# Altium schematic sheet MicroControllerSTM32f103.SchDoc
size A4
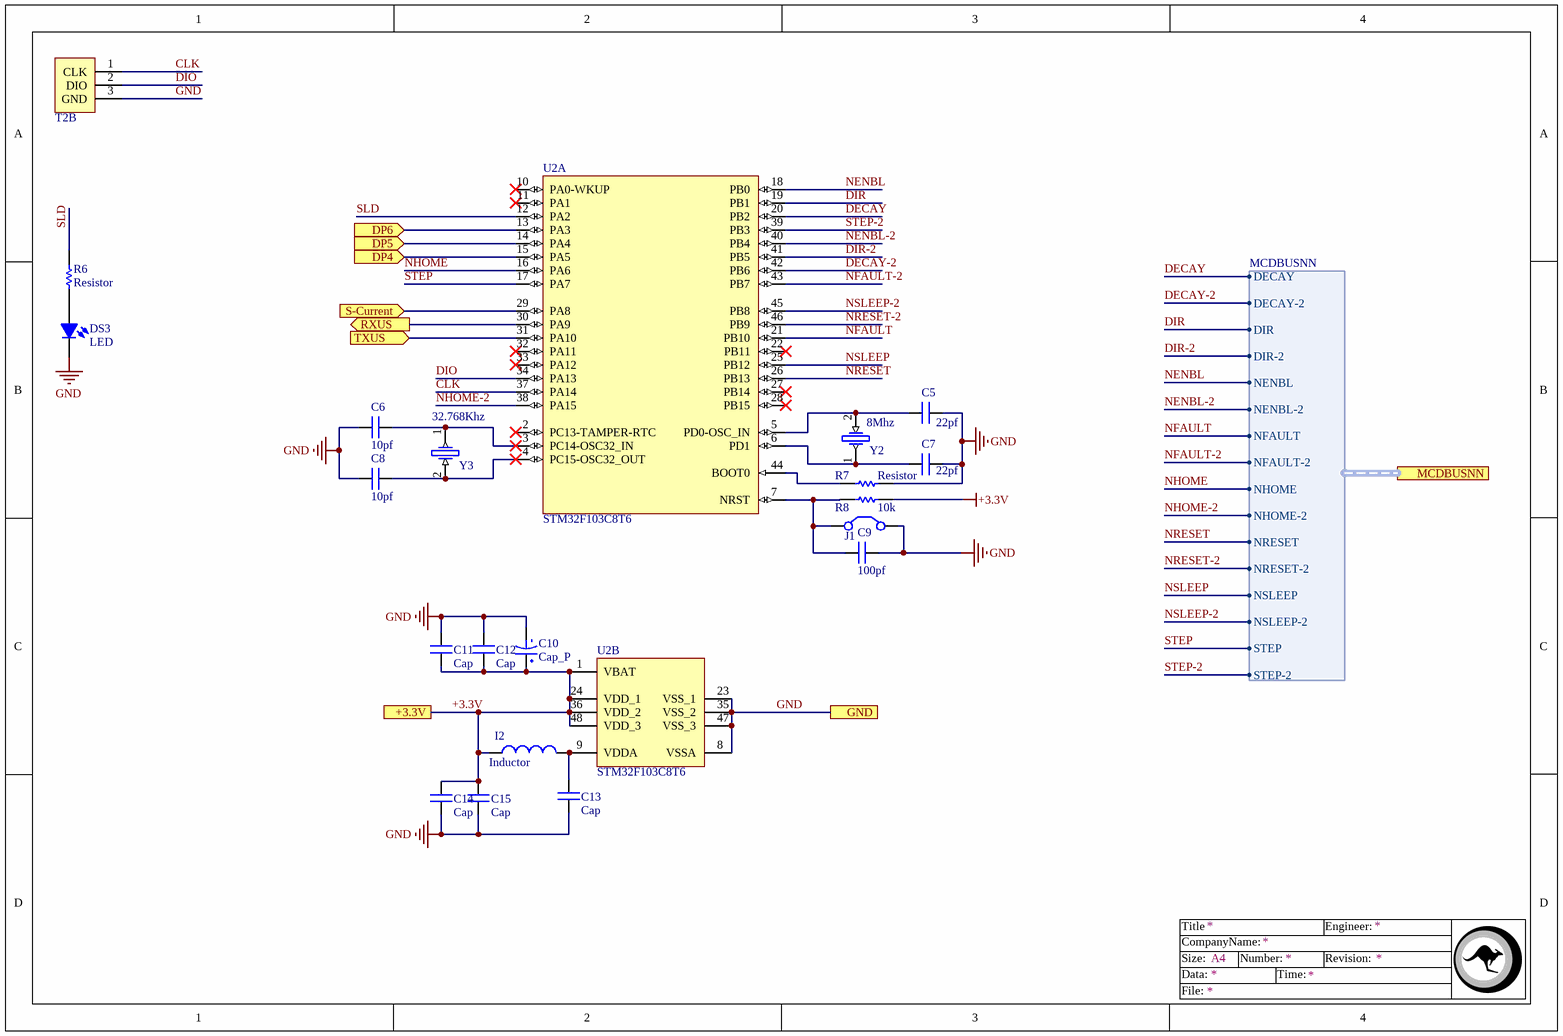
[diagram p0: MicroControllerSTM32f103.SchDoc]

## Parts
C5  22pf  [Cap0805]
C6  10pf  [Cap0805]
C7  22pf  [Cap0805]
C8  10pf  [Cap0805]
C9  100pf  [Cap0805]
C10  Cap_P  [CAPMOL_C]
C11  Cap  [Cap0805]
C12  Cap  [Cap0805]
C13  Cap  [Cap0805]
C14  Cap  [Cap0805]
C15  Cap  [Cap0805]
DS3  LED  [Led0805]
I2  Inductor  [1206]
J1  Jumper  [Jumper SMD - Small]  (value not drawn)
R6  Resistor  [R0805]
R7  Resistor  [R0805]
R8  10k  [R0805]
T2  Serial Program  [MHDR1X03-254P - E]  (value not drawn)  (part B of 2)
U2  STM32F103C8T6  [LQFP48_L]  (parts A,B of 2)
Y2  8Mhz  [CrystallB]
Y3  32.768Khz  [CrystallB]

## Ports
+3.3V, DP4 (in), DP5 (in), DP6 (in), GND, MCDBUSNN (harness MCDBUSNN), RXUS (out), S-Current (in), TXUS (in)

## Harnesses
MCDBUSNN: DECAY, DECAY-2, DIR, DIR-2, NENBL, NENBL-2, NFAULT, NFAULT-2, NHOME, NHOME-2, NRESET, NRESET-2, NSLEEP, NSLEEP-2, STEP, STEP-2

## Nets
+3.3V: C10.2 C11.1 C12.1 C14.2 C15.2 I2.1 R8.1 U2.1(VBAT) U2.24(VDD_1) U2.36(VDD_2) U2.48(VDD_3) ; port +3.3V
GND: C5.1 C6.1 C7.1 C8.1 C9.2 C10.1 C11.2 C12.2 C13.1 C14.1 C15.1 DS3.K J1.2(C2) R7.2 T2.3(GND) U2.8(VSSA) U2.23(VSS_1) U2.35(VSS_2) U2.47(VSS_3) ; port GND
CLK: T2.1(CLK) U2.37(PA14)
DECAY: U2.20(PB2) ; port MCDBUSNN.DECAY
DECAY-2: U2.42(PB6) ; port MCDBUSNN.DECAY-2
DIO: T2.2(DIO) U2.34(PA13)
DIR: U2.19(PB1) ; port MCDBUSNN.DIR
DIR-2: U2.41(PB5) ; port MCDBUSNN.DIR-2
DP4: U2.15(PA5) ; port DP4
DP5: U2.14(PA4) ; port DP5
DP6: U2.13(PA3) ; port DP6
NENBL: U2.18(PB0) ; port MCDBUSNN.NENBL
NENBL-2: U2.40(PB4) ; port MCDBUSNN.NENBL-2
NFAULT: U2.21(PB10) ; port MCDBUSNN.NFAULT
NFAULT-2: U2.43(PB7) ; port MCDBUSNN.NFAULT-2
NHOME: U2.16(PA6) ; port MCDBUSNN.NHOME
NHOME-2: U2.38(PA15) ; port MCDBUSNN.NHOME-2
NRESET: U2.26(PB13) ; port MCDBUSNN.NRESET
NRESET-2: U2.46(PB9) ; port MCDBUSNN.NRESET-2
NSLEEP: U2.25(PB12) ; port MCDBUSNN.NSLEEP
NSLEEP-2: U2.45(PB8) ; port MCDBUSNN.NSLEEP-2
RXUS: U2.30(PA9) ; port RXUS
S-Current: U2.29(PA8) ; port S-Current
SLD: R6.1 U2.12(PA2)
STEP: U2.17(PA7) ; port MCDBUSNN.STEP
STEP-2: U2.39(PB3) ; port MCDBUSNN.STEP-2
TXUS: U2.31(PA10) ; port TXUS
NetC5_2: C5.2 U2.5(PD0-OSC_IN) Y2.2
NetC6_2: C6.2 U2.3(PC14-OSC32_IN) Y3.1
NetC7_2: C7.2 U2.6(PD1) Y2.1
NetC8_2: C8.2 U2.4(PC15-OSC32_OUT) Y3.2
NetC9_1: C9.1 J1.1(C1) R8.2 U2.7(NRST)
NetC13_2: C13.2 I2.2 U2.9(VDDA)
NetDS3_A: DS3.A R6.2
NetR7_1: R7.1 U2.44(BOOT0)

Not connected (* = marked no-connect by the designer): U2 2(PC13-TAMPER-RTC)* 10(PA0-WKUP)* 11(PA1)* 22(PB11)* 27(PB14)* 28(PB15)* 32(PA11)* 33(PA12)*

## Notes on the sheet
- Title
- Size:
- Data:
- CompanyName:
- A4
- Number:
- Time:
- Revision:
- Engineer:
- File:

## Library data of the parts
C5-C9 C11-C15 = Cap: Surface mount Capacitor
C10 = Cap_P: Polarity
I2 = Inductor: Indicator
R8 = Resistor
T2 = Serial Program: STM Serial Program pin
U2 = STM32F103C8T6: STM32 ARM-based 32-bit MCU Performance Line with 64 kB Flash, 20 kB Internal RAM, -40 to +85°C Temperature, 48-Pin LQFP, Tray; DatasheetVersion: rev13.0, Apr-2011; PackageVersion: rev13, Apr-2011; PackageReference: LQFP48; PackageDescription: 48-Pin Low-Profile Quad Flat Pack, 7 x 7 mm Body, 0.5 mm Pitch (LQFP48); ComponentLink1Description: Manufacturer URL; ComponentLink1URL: http://www.st.com/; ComponentLink2Description: STM32F103 Datasheet; ComponentLink2URL: http://www.st.com/internet/com/TECHNICAL_RESOURCES/TECHNICAL_LITERATURE/DATASHEET/CD00161566.pdf; ComponentLink3Description: STM32 Family Web Page; ComponentLink3URL: www.st.com/stm32
Y2 Y3 = Crystal